# Altium project Buffer.PrjPCB
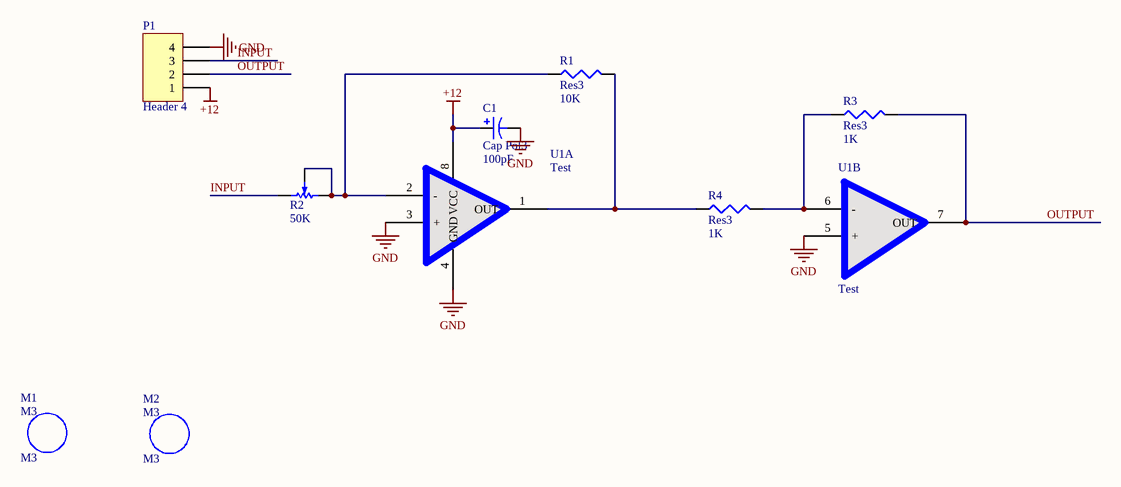
[diagram p0: Buffer.SchDoc]
1 sheet, 9 parts. Net scope: global (net labels, ports and power ports of the same name join across sheets).
Board file: Buffer.PcbDoc

## Sheet Buffer.SchDoc
size Letter

### Parts
C1  Cap Pol3  value 100pF  [1206]
M1  M3  [M3 Mounting Hole]
M2  M3  [M3 Mounting Hole]
P1  Header 4  [HDR1X4]
R1  Res3  value 10K  [1206]
R2  50K  [POT]
R3  Res3  value 1K  [1206]
R4  Res3  value 1K  [1206]
U1  Test  [SO8]  (parts A,B of 2)

### Nets
+12: C1.1 P1.1 U1.8(VCC)
GND: C1.2 P1.4 U1.3(+) U1.4(GND) U1.5(+)
INPUT: P1.3 R2.CW(+)
OUTPUT: P1.2 R3.2 U1.7(OUT)
NetR1_1: R1.1 R2.CCW(-) R2.W U1.2(-)
NetR1_2: R1.2 R4.1 U1.1(OUT)
NetR3_1: R3.1 R4.2 U1.6(-)

### Notes on the sheet
- Date:
- Revision:
- Sheet:
- /

### Library data of the parts
C1 = Cap Pol3: Polarized Capacitor (Surface Mount); Published: 8-Jun-2000; LatestRevisionDate: 29-May-2009; LatestRevisionNote: IPC-7351 Footprint Added.; PackageReference: C0805; Publisher: Altium Limited; PackageDescription: Chip Capacitor
P1 = Header 4: Header, 4-Pin; LatestRevisionDate: 17-Jul-2002; LatestRevisionNote: Re-released for DXP Platform.; Publisher: Altium Limited
R1 R3 R4 = Res3: Resistor; Published: 8-Jun-2000; LatestRevisionDate: 29-May-2009; LatestRevisionNote: IPC-7351 Footprint Added.; PackageReference: J1-0603; Publisher: Altium Limited; PackageDescription: Chip Resistor
R2 = RPot SM: Square Trimming Potentiometer; Published: 17-Dec-2003; DatasheetVersion: Oct-2003; PackageReference: POT4MM-2; Publisher: Altium Limited; PackageDescription: Square Trimming Potentiometer; ComponentLink1Description: Manufacturer Link; ComponentLink1URL: http://bourns.com/2/search.html